# Altium schematic sheet Sheet1.SchDoc
size A; SheetNumber: 1; SheetTotal: 1
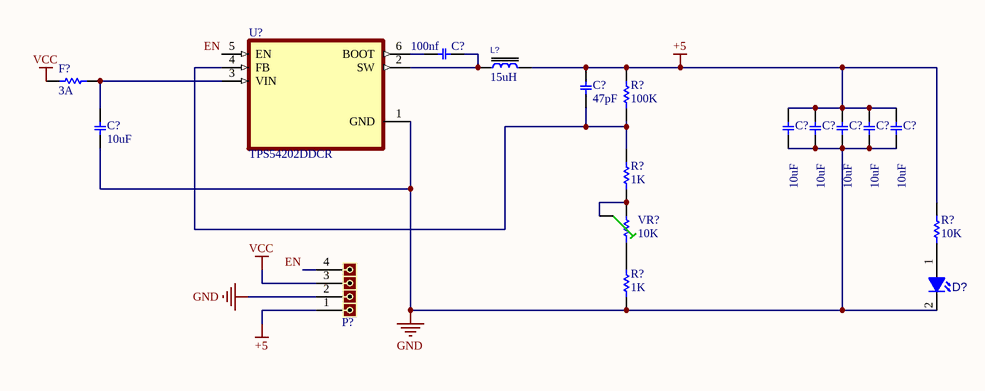
[diagram p0: Sheet1.SchDoc]

## Parts
(Parts that share a designator on the sheet are numbered #1, #2 ... from top to bottom, then left to right.)
C?#1  value 100nf  [C0805E]  (hidden comment: Capacitor SMD 0805)
C?#2  value 47pF  [C0805E]  (hidden comment: Capacitor SMD 0805)
C?#3  value 10uF  [C1206E]  (hidden comment: Capacitor SMD 1206)
C?#4  value 10uF  [C1206]  (hidden comment: Capacitor SMD 1206)
C?#5  value 10uF  [C1206]  (hidden comment: Capacitor SMD 1206)
C?#6  value 10uF  [C1206]  (hidden comment: Capacitor SMD 1206)
C?#7  value 10uF  [C1206]  (hidden comment: Capacitor SMD 1206)
C?#8  value 10uF  [C1206]  (hidden comment: Capacitor SMD 1206)
D?  LED SMD 0805  [LED SMD 0805 (Blue)]  (value not drawn)
F?  value 3A  [SMD-1206-RES]  (hidden comment: Resistor SMD 1206)
L?  value 15uH  [L7]  (hidden comment: Inductor SMD Cored)
P?  Male Header Single 04  [MHDR1X04-254P]  (value not drawn)
R?#1  value 100K  [R0805E]  (hidden comment: Resistor SMD 0805)
R?#2  value 1K  [R0805E]  (hidden comment: Resistor SMD 0805)
R?#3  value 10K  [R0805E]  (hidden comment: Resistor SMD 0805)
R?#4  value 1K  [R0805E]  (hidden comment: Resistor SMD 0805)
U?  TPS54202DDCR  [SOT95P280X110-6N]
VR?  value 10K  [3296W]  (hidden comment: Potentiometr Trimer / Multi Turn THD)

## Nets
+5: C?#2.2 C?#4.2 C?#5.2 C?#6.2 C?#7.2 C?#8.2 L?.2 P?.1 R?#1.2 R?#3.2
GND: C?#3.1 C?#4.1 C?#5.1 C?#6.1 C?#7.1 C?#8.1 D?.2(CATHODE) P?.2 R?#4.1 U?.1(GND)
VCC: F?.1 P?.3
EN: P?.4 U?.5(EN)
NetC?#1_1: C?#1.1 L?.1 U?.2(SW)
NetC?#1_2: C?#1.2 U?.6(BOOT)
NetC?#2_1: C?#2.1 R?#1.1 R?#2.1 U?.4(FB)
NetC?#3_2: C?#3.2 F?.2 U?.3(VIN)
NetD?_1: D?.1(ANODE) R?#3.1
NetR?#2_2: R?#2.2 VR?.2 VR?.3
NetR?#4_2: R?#4.2 VR?.1

## Library data of the parts
C?#1 C?#2 = Capacitor SMD 0805: Capacitor C SMD 0805; DatasheetVersion: 2022; ComponentLink1Description: Tarahiboard; ComponentLink1URL: https://www.tarahiboard.com
C?#3-C?#8 = Capacitor SMD 1206: Capacitor C SMD 1206; DatasheetVersion: 2022; ComponentLink1Description: Tarahiboard; ComponentLink1URL: https://www.tarahiboard.com
P? = Male Header Single 04: Male, pitch: 2.54mm; ComponentLink1Description: Tarahiboard; ComponentLink1URL: https://www.tarahiboard.com/product/library-pack; DatasheetVersion: 2022
U? = TPS54202DDCR: MF: {'manufacturer': u'Texas Instruments'}; Package: None; Price: None; Value: *; MP: TPS54202DDCR; Availability: Unavailable
D? = LED SMD 0805: ComponentLink1Description: Tarahiboard; ComponentLink1URL: https://www.tarahiboard.com/product/library-pack; DatasheetVersion: 2022
F? = Resistor SMD 1206: DatasheetVersion: 2022; ComponentLink1Description: Website: Tarahiboard; ComponentLink1URL: https://www.tarahiboard.com/product/library-pack
L? = Inductor SMD Cored: DatasheetVersion: 2022; ComponentLink1Description: Tarahiboard; ComponentLink1URL: https://www.tarahiboard.com/product/library-pack
R?#1-R?#4 = Resistor SMD 0805: DatasheetVersion: 2022; ComponentLink1Description: Website: Tarahiboard; ComponentLink1URL: https://www.tarahiboard.com/product/library-pack
VR? = Potentiometr Trimer / Multi Turn THD: DatasheetVersion: 2022; ComponentLink1Description: Tarahiboard; ComponentLink1URL: https://www.tarahiboard.com/product/library-pack